# Altium project PCB_Slave_Traffic_Light.PrjPcb (part 2 of 4)
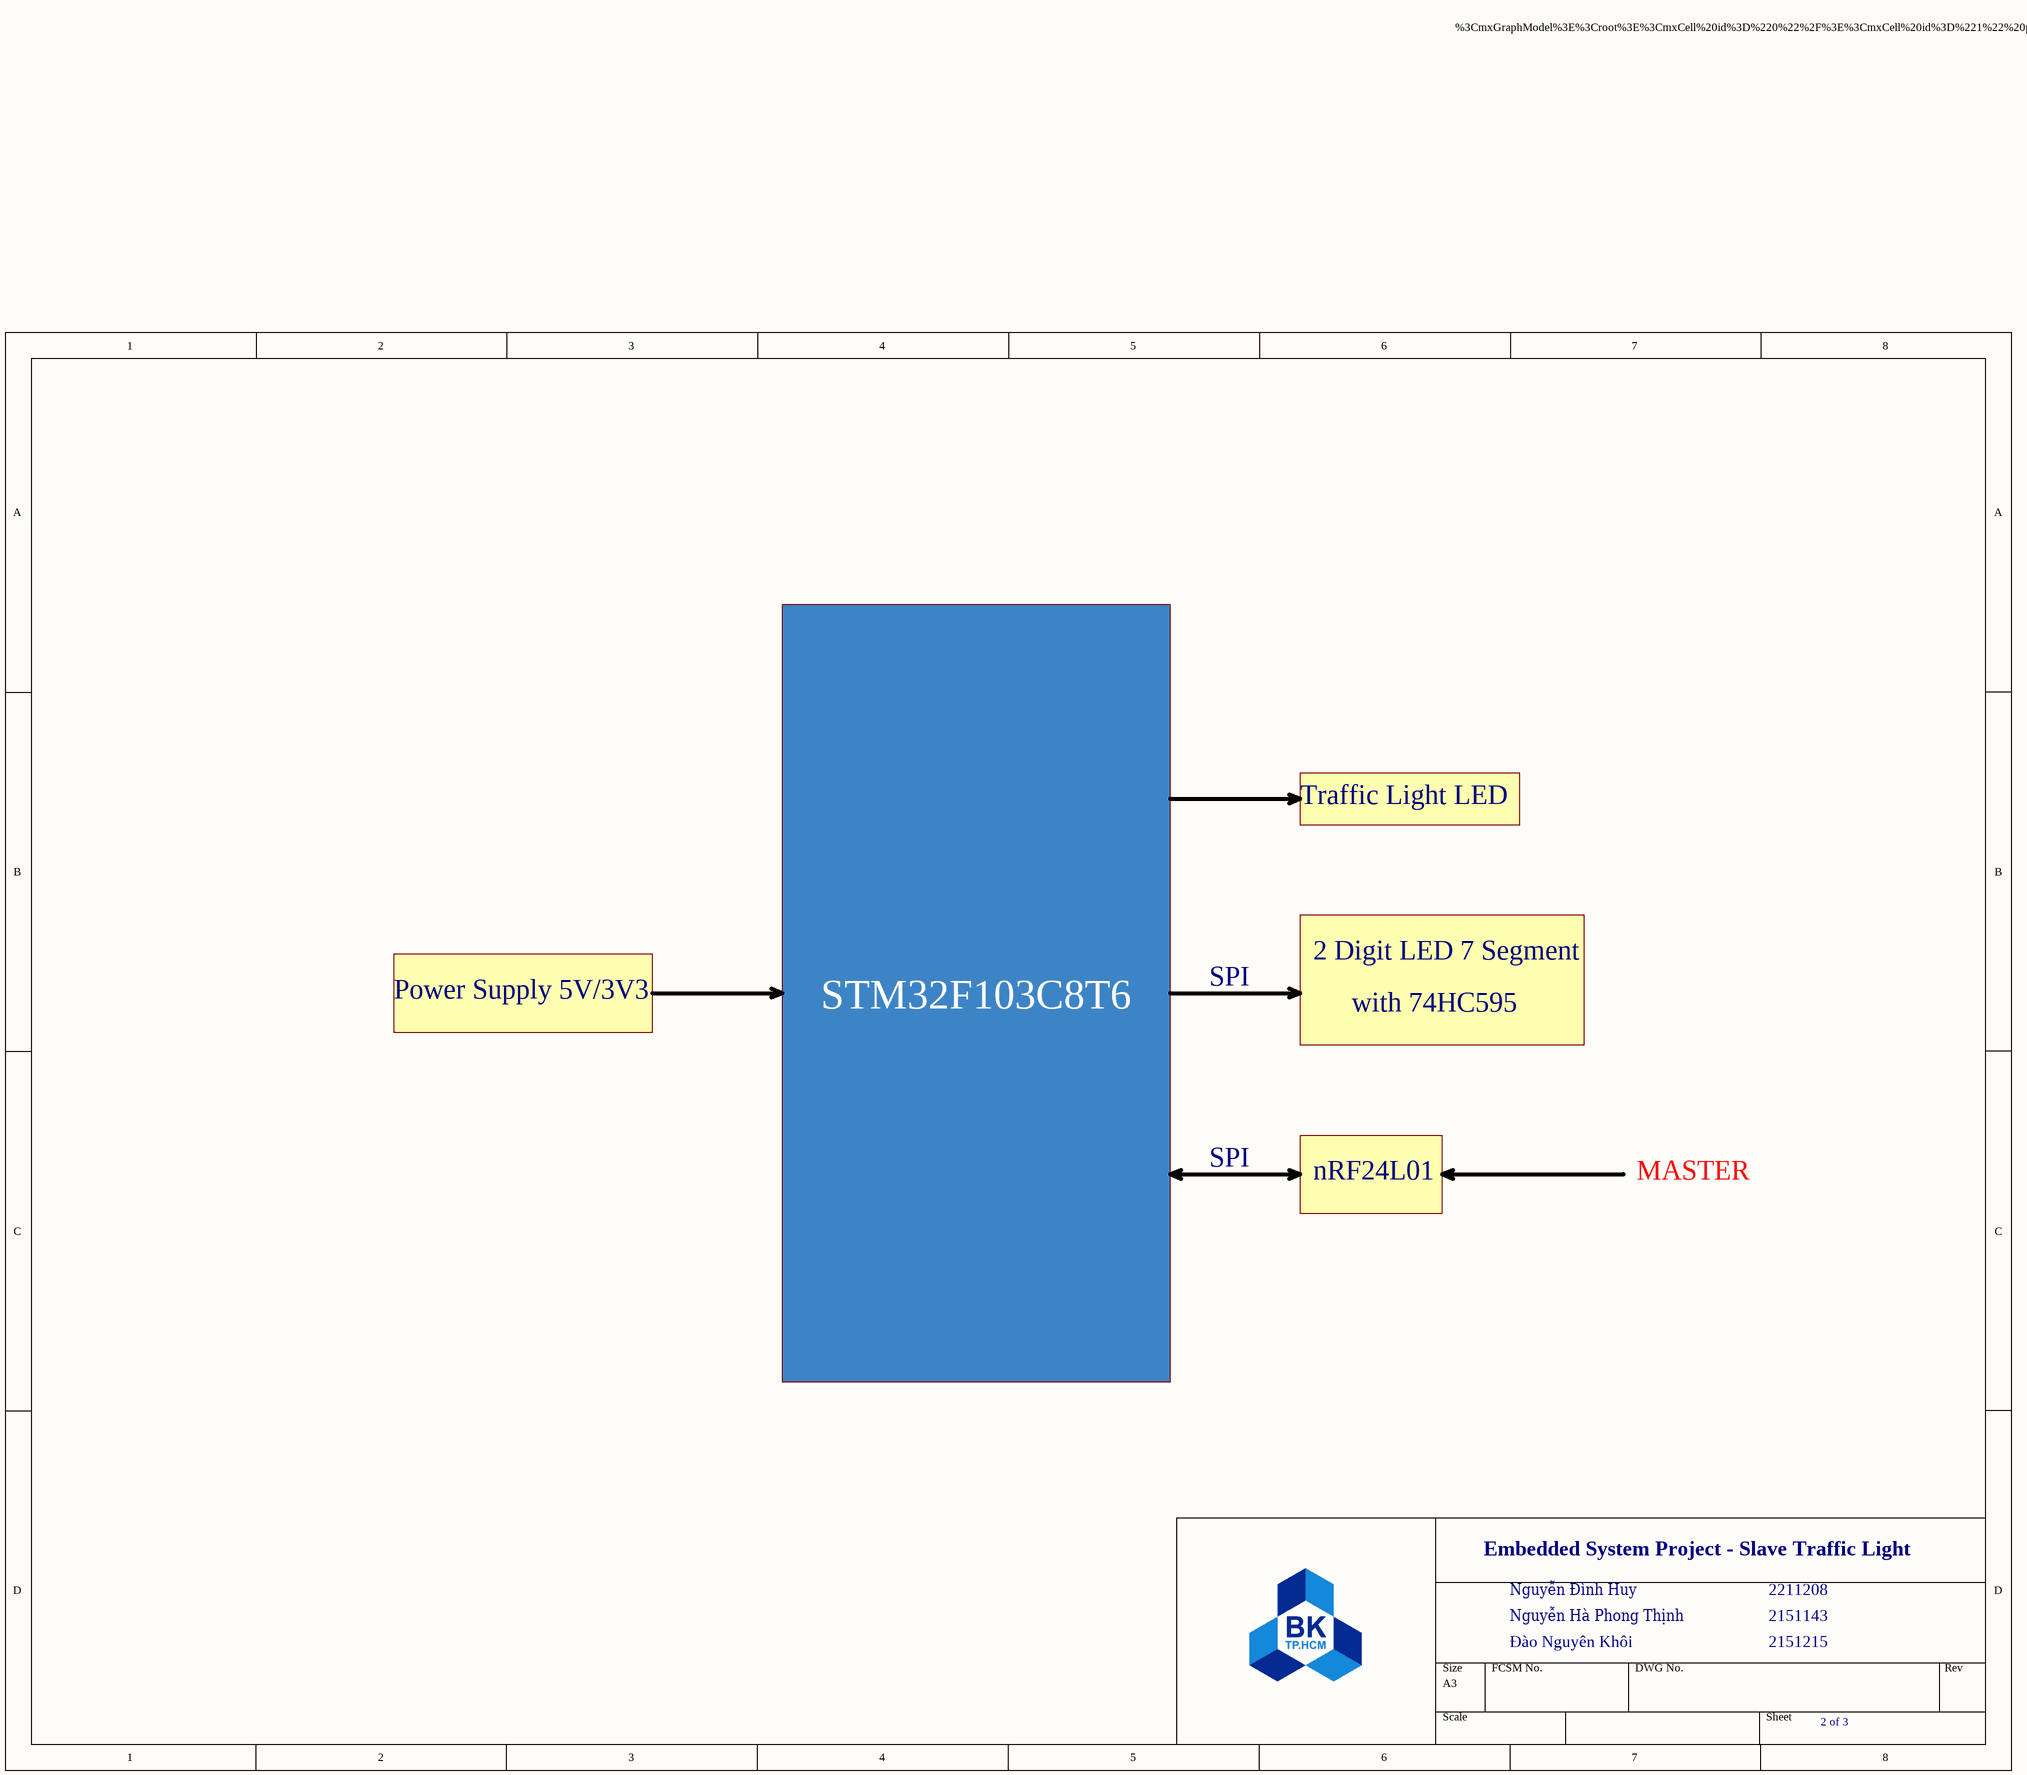
[diagram p3: PCB_Slave_Traffic_Light_BLOCK_DIAGRAM.SchDoc]

## Sheet PCB_Slave_Traffic_Light_BLOCK_DIAGRAM.SchDoc (continued)
- %3CmxGraphModel%3E%3Croot%3E%3CmxCell%20id%3D%220%22%2F%3E%3CmxCell%20id%3D%221%22%20parent%3D%220%22%2F%3E%3CmxCell%20id%3D%222%22%20value%3D%22%22%20style%3D%22endArrow%3Dnone%3Bhtml%3D1%3Brounded%3D0%3Bmovable%3D1%3Bresizable%3D1%3Brotatable%3D1%3Bdeletable%3D1%3Beditable%3D1%3Blocked%3D0%3Bconnectable%3D1%3B%22%20edge%3D%221%22%20parent%3D%221%22%3E%3CmxGeometry%20width%3D%2250%22%20height%3D%2250%22%20relative%3D%221%22%20as%3D%22geometry%22%3E%3CmxPoint%20x%3D%221039.998461538461%22%20y%3D%221800%22%20as%3D%22sourcePoint%22%2F%3E%3CmxPoint%20x%3D%221039.998461538461%22%20y%3D%221820%22%20as%3D%22targetPoint%22%2F%3E%3C%2FmxGeometry%3E%3C%2FmxCell%3E%3CmxCell%20id%3D%223%22%20value%3D%22%22%20style%3D%22endArrow%3Dnone%3Bhtml%3D1%3Brounded%3D0%3Bmovable%3D1%3Bresizable%3D1%3Brotatable%3D1%3Bdeletable%3D1%3Beditable%3D1%3Blocked%3D0%3Bconnectable%3D1%3B%22%20edge%3D%221%22%20parent%3D%221%22%3E%3CmxGeometry%20width%3D%2250%22%20height%3D%2250%22%20relative%3D%221%22%20as%3D%22geometry%22%3E%3CmxPoint%20x%3D%221010%22%20y%3D%221799.9956410256416%22%20as%3D%22sourcePoint%22%2F%3E%3CmxPoint%20x%3D%221070%22%20y%3D%221799.9956410256416%22%20as%3D%22targetPoint%22%2F%3E%3C%2FmxGeometry%3E%3C%2FmxCell%3E%3CmxCell%20id%3D%224%22%20value%3D%22%22%20style%3D%22endArrow%3Dnone%3Bhtml%3D1%3Brounded%3D0%3Bmovable%3D1%3Bresizable%3D1%3Brotatable%3D1%3Bdeletable%3D1%3Beditable%3D1%3Blocked%3D0%3Bconnectable%3D1%3B%22%20edge%3D%221%22%20parent%3D%221%22%3E%3CmxGeometry%20width%3D%2250%22%20height%3D%2250%22%20relative%3D%221%22%20as%3D%22geometry%22%3E%3CmxPoint%20x%3D%221020%22%20y%3D%221789.9956410256416%22%20as%3D%22sourcePoint%22%2F%3E%3CmxPoint%20x%3D%221060%22%20y%3D%221789.9956410256416%22%20as%3D%22targetPoint%22%2F%3E%3C%2FmxGeometry%3E%3C%2FmxCell%3E%3CmxCell%20id%3D%225%22%20value%3D%22%22%20style%3D%22endArrow%3Dnone%3Bhtml%3D1%3Brounded%3D0%3Bmovable%3D1%3Bresizable%3D1%3Brotatable%3D1%3Bdeletable%3D1%3Beditable%3D1%3Blocked%3D0%3Bconnectable%3D1%3B%22%20edge%3D%221%22%20parent%3D%221%22%3E%3CmxGeometry%20width%3D%2250%22%20height%3D%2250%22%20relative%3D%221%22%20as%3D%22geometry%22%3E%3CmxPoint%20x%3D%221030%22%20y%3D%221778.9956410256416%22%20as%3D%22sourcePoint%22%2F%3E%3CmxPoint%20x%3D%221050%22%20y%3D%221778.9956410256416%22%20as%3D%22targetPoint%22%2F%3E%3C%2FmxGeometry%3E%3C%2FmxCell%3E%3CmxCell%20id%3D%226%22%20value%3D%22STM32%22%20style%3D%22rounded%3D0%3BwhiteSpace%3Dwrap%3Bhtml%3D1%3B%22%20vertex%3D%221%22%20parent%3D%221%22%3E%3CmxGeometry%20x%3D%22634.4%22%20y%3D%221594%22%20width%3D%22120%22%20height%3D%22200%22%20as%3D%22geometry%22%2F%3E%3C%2FmxCell%3E%3CmxCell%20id%3D%227%22%20style%3D%22edgeStyle%3DorthogonalEdgeStyle%3Brounded%3D0%3BorthogonalLoop%3D1%3BjettySize%3Dauto%3Bhtml%3D1%3BexitX%3D0%3BexitY%3D0.25%3BexitDx%3D0%3BexitDy%3D0%3BendArrow%3Dnone%3BstartFill%3D0%3B%22%20edge%3D%221%22%20source%3D%229%22%20parent%3D%221%22%3E%3CmxGeometry%20relative%3D%221%22%20as%3D%22geometry%22%3E%3CmxPoint%20x%3D%22840%22%20y%3D%221580%22%20as%3D%22targetPoint%22%2F%3E%3CArray%20as%3D%22points%22%3E%3CmxPoint%20x%3D%22840%22%20y%3D%221574%22%2F%3E%3C%2FArray%3E%3C%2FmxGeometry%3E%3C%2FmxCell%3E%3CmxCell%20id%3D%228%22%20style%3D%22edgeStyle%3DorthogonalEdgeStyle%3Brounded%3D0%3BorthogonalLoop%3D1%3BjettySize%3Dauto%3Bhtml%3D1%3BexitX%3D1%3BexitY%3D0.25%3BexitDx%3D0%3BexitDy%3D0%3BendArrow%3Dnone%3BstartFill%3D0%3B%22%20edge%3D%221%22%20parent%3D%221%22%3E%3CmxGeometry%20relative%3D%221%22%20as%3D%22geometry%22%3E%3CmxPoint%20x%3D%221240%22%20y%3D%221573.7955555555554%22%20as%3D%22targetPoint%22%2F%3E%3CmxPoint%20x%3D%221104.4%22%20y%3D%221573.8700000000003%22%20as%3D%22sourcePoint%22%2F%3E%3C%2FmxGeometry%3E%3C%2FmxCell%3E%3CmxCell%20id%3D%229%22%20value%3D%222%20digit%20led%207%26amp%3Bnbsp%3B%26lt%3Bdiv%26gt%3Bsegment%26amp%3Bnbsp%3B%26lt%3Bdiv%26gt%3Bwith%2074hc595%26lt%3B%2Fdiv%26gt%3B%26lt%3B%2Fdiv%26gt%3B%22%20style%3D%22rounded%3D0%3BwhiteSpace%3Dwrap%3Bhtml%3D1%3B%22%20vertex%3D%221%22%20parent%3D%221%22%3E%3CmxGeometry%20x%3D%22944.4%22%20y%3D%221554.13%22%20width%3D%22160%22%20height%3D%2280%22%20as%3D%22geometry%22%2F%3E%3C%2FmxCell%3E%3CmxCell%20id%3D%2210%22%20style%3D%22edgeStyle%3DorthogonalEdgeStyle%3Brounded%3D0%3BorthogonalLoop%3D1%3BjettySize%3Dauto%3Bhtml%3D1%3BexitX%3D0%3BexitY%3D0.5%3BexitDx%3D0%3BexitDy%3D0%3BendArrow%3Dnone%3BstartFill%3D0%3B%22%20edge%3D%221%22%20source%3D%2212%22%20parent%3D%221%22%3E%3CmxGeometry%20relative%3D%221%22%20as%3D%22geometry%22%3E%3CmxPoint%20x%3D%22840%22%20y%3D%221839.8596491228068%22%20as%3D%22targetPoint%22%2F%3E%3C%2FmxGeometry%3E%3C%2FmxCell%3E%3CmxCell%20id%3D%2211%22%20style%3D%22edgeStyle%3DorthogonalEdgeStyle%3Brounded%3D0%3BorthogonalLoop%3D1%3BjettySize%3Dauto%3Bhtml%3D1%3BexitX%3D1%3BexitY%3D0.5%3BexitDx%3D0%3BexitDy%3D0%3BendArrow%3Dnone%3BstartFill%3D0%3B%22%20edge%3D%221%22%20source%3D%2212%22%20parent%3D%221%22%3E%3CmxGeometry%20relative%3D%221%22%20as%3D%22geometry%22%3E%3CmxPoint%20x%3D%22920%22%20y%3D%221820%22%20as%3D%22targetPoint%22%2F%3E%3C%2FmxGeometry%3E%3C%2FmxCell%3E%3CmxCell%20id%3D%2212%22%20value%3D%22%22%20style%3D%22ellipse%3BwhiteSpace%3Dwrap%3Bhtml%3D1%3Baspect%3Dfixed%3B%22%20vertex%3D%221%22%20parent%3D%221%22%3E%3CmxGeometry%20x%3D%22870%22%20y%3D%221830%22%20width%3D%2220%22%20height%3D%2220%22%20as%3D%22geometry%22%2F%3E%3C%2FmxCell%3E%3CmxCell%20id%3D%2213%22%20style%3D%22edgeStyle%3DorthogonalEdgeStyle%3Brounded%3D0%3BorthogonalLoop%3D1%3BjettySize%3Dauto%3Bhtml%3D1%3BexitX%3D0%3BexitY%3D0.5%3BexitDx%3D0%3BexitDy%3D0%3BendArrow%3Dnone%3BstartFill%3D0%3B%22%20edge%3D%221%22%20source%3D%2215%22%20parent%3D%221%22%3E%3CmxGeometry%20relative%3D%221%22%20as%3D%22geometry%22%3E%3CmxPoint%20x%3D%22960%22%20y%3D%221839.9824561403507%22%20as%3D%22targetPoint%22%2F%3E%3C%2FmxGeometry%3E%3C%2FmxCell%3E%3CmxCell%20id%3D%2214%22%20style%3D%22edgeStyle%3DorthogonalEdgeStyle%3Brounded%3D0%3BorthogonalLoop%3D1%3BjettySize%3Dauto%3Bhtml%3D1%3BexitX%3D1%3BexitY%3D0.5%3BexitDx%3D0%3BexitDy%3D0%3BendArrow%3Dnone%3BstartFill%3D0%3B%22%20edge%3D%221%22%20source%3D%2215%22%20parent%3D%221%22%3E%3CmxGeometry%20relative%3D%221%22%20as%3D%22geometry%22%3E%3CmxPoint%20x%3D%221040%22%20y%3D%221820%22%20as%3D%22targetPoint%22%2F%3E%3C%2FmxGeometry%3E%3C%2FmxCell%3E%3CmxCell%20id%3D%2215%22%20value%3D%22%22%20style%3D%22ellipse%3BwhiteSpace%3Dwrap%3Bhtml%3D1%3Baspect%3Dfixed%3B%22%20vertex%3D%221%22%20parent%3D%221%22%3E%3CmxGeometry%20x%3D%22990%22%20y%3D%221830%22%20width%3D%2220%22%20height%3D%2220%22%20as%3D%22geometry%22%2F%3E%3C%2FmxCell%3E%3CmxCell%20id%3D%2216%22%20style%3D%22edgeStyle%3DorthogonalEdgeStyle%3Brounded%3D0%3BorthogonalLoop%3D1%3BjettySize%3Dauto%3Bhtml%3D1%3BexitX%3D0%3BexitY%3D0.5%3BexitDx%3D0%3BexitDy%3D0%3BendArrow%3Dnone%3BstartFill%3D0%3B%22%20edge%3D%221%22%20source%3D%2218%22%20parent%3D%221%22%3E%3CmxGeometry%20relative%3D%221%22%20as%3D%22geometry%22%3E%3CmxPoint%20x%3D%22760%22%20y%3D%221879.8596491228068%22%20as%3D%22targetPoint%22%2F%3E%3C%2FmxGeometry%3E%3C%2FmxCell%3E%3CmxCell%20id%3D%2217%22%20style%3D%22edgeStyle%3DorthogonalEdgeStyle%3Brounded%3D0%3BorthogonalLoop%3D1%3BjettySize%3Dauto%3Bhtml%3D1%3BexitX%3D1%3BexitY%3D0.5%3BexitDx%3D0%3BexitDy%3D0%3BendArrow%3Dnone%3BstartFill%3D0%3B%22%20edge%3D%221%22%20source%3D%2218%22%20parent%3D%221%22%3E%3CmxGeometry%20relative%3D%221%22%20as%3D%22geometry%22%3E%3CmxPoint%20x%3D%22840%22%20y%3D%221900%22%20as%3D%22targetPoint%22%2F%3E%3C%2FmxGeometry%3E%3C%2FmxCell%3E%3CmxCell%20id%3D%2218%22%20value%3D%22%22%20style%3D%22ellipse%3BwhiteSpace%3Dwrap%3Bhtml%3D1%3Baspect%3Dfixed%3B%22%20vertex%3D%221%22%20parent%3D%221%22%3E%3CmxGeometry%20x%3D%22790%22%20y%3D%221870%22%20width%3D%2220%22%20height%3D%2220%22%20as%3D%22geometry%22%2F%3E%3C%2FmxCell%3E%3CmxCell%20id%3D%2219%22%20style%3D%22edgeStyle%3DorthogonalEdgeStyle%3Brounded%3D0%3BorthogonalLoop%3D1%3BjettySize%3Dauto%3Bhtml%3D1%3BexitX%3D0%3BexitY%3D0.5%3BexitDx%3D0%3BexitDy%3D0%3BendArrow%3Dnone%3BstartFill%3D0%3B%22%20edge%3D%221%22%20source%3D%2221%22%20parent%3D%221%22%3E%3CmxGeometry%20relative%3D%221%22%20as%3D%22geometry%22%3E%3CmxPoint%20x%3D%22880%22%20y%3D%221879.8596491228068%22%20as%3D%22targetPoint%22%2F%3E%3C%2FmxGeometry%3E%3C%2FmxCell%3E%3CmxCell%20id%3D%2220%22%20style%3D%22edgeStyle%3DorthogonalEdgeStyle%3Brounded%3D0%3BorthogonalLoop%3D1%3BjettySize%3Dauto%3Bhtml%3D1%3BexitX%3D1%3BexitY%3D0.5%3BexitDx%3D0%3BexitDy%3D0%3BendArrow%3Dnone%3BstartFill%3D0%3B%22%20edge%3D%221%22%20source%3D%2221%22%20parent%3D%221%22%3E%3CmxGeometry%20relative%3D%221%22%20as%3D%22geometry%22%3E%3CmxPoint%20x%3D%22960%22%20y%3D%221900%22%20as%3D%22targetPoint%22%2F%3E%3C%2FmxGeometry%3E%3C%2FmxCell%3E%3CmxCell%20id%3D%2221%22%20value%3D%22%22%20style%3D%22ellipse%3BwhiteSpace%3Dwrap%3Bhtml%3D1%3Baspect%3Dfixed%3B%22%20vertex%3D%221%22%20parent%3D%221%22%3E%3CmxGeometry%20x%3D%22908.04%22%20y%3D%221870%22%20width%3D%2220%22%20height%3D%2220%22%20as%3D%22geometry%22%2F%3E%3C%2FmxCell%3E%3CmxCell%20id%3D%2222%22%20style%3D%22edgeStyle%3DorthogonalEdgeStyle%3Brounded%3D0%3BorthogonalLoop%3D1%3BjettySize%3Dauto%3Bhtml%3D1%3BexitX%3D0%3BexitY%3D0.5%3BexitDx%3D0%3BexitDy%3D0%3BendArrow%3Dnone%3BstartFill%3D0%3B%22%20edge%3D%221%22%20source%3D%2224%22%20parent%3D%221%22%3E%3CmxGeometry%20relative%3D%221%22%20as%3D%22geometry%22%3E%3CmxPoint%20x%3D%221000%22%20y%3D%221879.8596491228068%22%20as%3D%22targetPoint%22%2F%3E%3C%2FmxGeometry%3E%3C%2FmxCell%3E%3CmxCell%20id%3D%2223%22%20style%3D%22edgeStyle%3DorthogonalEdgeStyle%3Brounded%3D0%3BorthogonalLoop%3D1%3BjettySize%3Dauto%3Bhtml%3D1%3BexitX%3D1%3BexitY%3D0.5%3BexitDx%3D0%3BexitDy%3D0%3BendArrow%3Dnone%3BstartFill%3D0%3B%22%20edge%3D%221%22%20source%3D%2224%22%20parent%3D%221%22%3E%3CmxGeometry%20relative%3D%221%22%20as%3D%22geometry%22%3E%3CmxPoint%20x%3D%221080%22%20y%3D%221900%22%20as%3D%22targetPoint%22%2F%3E%3C%2FmxGeometry%3E%3C%2FmxCell%3E%3CmxCell%20id%3D%2224%22%20value%3D%22%22%20style%3D%22ellipse%3BwhiteSpace%3Dwrap%3Bhtml%3D1%3Baspect%3Dfixed%3B%22%20vertex%3D%221%22%20parent%3D%221%22%3E%3CmxGeometry%20x%3D%221030%22%20y%3D%221870%22%20width%3D%2220%22%20height%3D%2220%22%20as%3D%22geometry%22%2F%3E%3C%2FmxCell%3E%3CmxCell%20id%3D%2225%22%20value%3D%22LCD%2016x2%26lt%3Bdiv%26gt%3B%2B%26lt%3B%2Fdiv%26gt%3B%26lt%3Bdiv%26gt%3BI2C%20Module%26lt%3B%2Fdiv%26gt%3B%22%20style%3D%22rounded%3D0%3BwhiteSpace%3Dwrap%3Bhtml%3D1%3Brotation%3D0%3B%22%20vertex%3D%221%22%20parent%3D%221%22%3E%3CmxGeometry%20x%3D%22234.4%22%20y%3D%221754%22%20width%3D%22120%22%20height%3D%22240%22%20as%3D%22geometry%22%2F%3E%3C%2FmxCell%3E%3CmxCell%20id%3D%2226%22%20value%3D%22AC%26amp%3Bnbsp%3B%26lt%3Bdiv%26gt%3BConnector%26lt%3B%2Fdiv%26gt%3B%22%20style%3D%22rounded%3D0%3BwhiteSpace%3Dwrap%3Bhtml%3D1%3B%22%20vertex%3D%221%22%20parent%3D%221%22%3E%3CmxGeometry%20x%3D%2280%22%20y%3D%221553.46%22%20width%3D%22130%22%20height%3D%2280%22%20as%3D%22geometry%22%2F%3E%3C%2FmxCell%3E%3CmxCell%20id%3D%2227%22%20value%3D%22AC-DC%26amp%3Bnbsp%3B%26lt%3Bdiv%26gt%3BConverter%26lt%3B%2Fdiv%26gt%3B%22%20style%3D%22rounded%3D0%3BwhiteSpace%3Dwrap%3Bhtml%3D1%3B%22%20vertex%3D%221%22%20parent%3D%221%22%3E%3CmxGeometry%20x%3D%22240%22%20y%3D%221553.46%22%20width%3D%22160%22%20height%3D%2280%22%20as%3D%22geometry%22%2F%3E%3C%2FmxCell%3E%3CUserObject%20label%3D%22%26lt%3Ba%20href%3D%26quot%3Bhttps%3A%2F%2Fwww.thegioiic.com%2Fmodule-2-led-7-doan-0-5inch-74hc595-5vdc%26quot%3B%26gt%3BModule%202%20LED%207%20%C4%90o%E1%BA%A1n%200.5inch%2074HC595%205VDC%20%C4%90%E1%BB%8F%2C%20v%C3%A0o%3A%205VDC%2C%20k%C3%ADch%20th%C6%B0%E1%BB%9Bc%3A%2038x25mm%26lt%3B%2Fa%26gt%3B%22%20link%3D%22%26lt%3Ba%20href%3D%26quot%3Bhttps%3A%2F%2Fhshop.vn%2Fmach-hien-thi-2-led-7-doan-0-5-inch-74hc595%26quot%3B%26gt%3BM%E1%BA%A1ch%20hi%E1%BB%83n%20th%E1%BB%8B%20Led%207%20%C4%91o%E1%BA%A1n%2074HC595%202-Digit%20Display%200.56%20Inch%20Module%26lt%3B%2Fa%26gt%3B%22%20id%3D%2228%22%3E%3CmxCell%20style%3D%22text%3BwhiteSpace%3Dwrap%3Bhtml%3D1%3B%22%20vertex%3D%221%22%20parent%3D%221%22%3E%3CmxGeometry%20x%3D%22944.4%22%20y%3D%221634.13%22%20width%3D%22162.72%22%20height%3D%2252%22%20as%3D%22geometry%22%2F%3E%3C%2FmxCell%3E%3C%2FUserObject%3E%3CUserObject%20label%3D%22%26lt%3Ba%20href%3D%26quot%3Bhttps%3A%2F%2Fwww.thegioiic.com%2Fmach-chuyen-doi-ac-dc-vao-220v-ra-5v-700ma-3-3v-600ma-3-5w%26quot%3B%26gt%3BM%E1%BA%A1ch%20Chuy%E1%BB%83n%20%C4%90%E1%BB%95i%20AC-DC%20V%C3%A0o%20220V%20Ra%205V%20700mA%2C%203.3V%20600mA%203.5W%20%C4%90i%E1%BB%87n%20%C3%A1p%20v%C3%A0o%3A%20220VAC%26lt%3B%2Fa%26gt%3B%22%20link%3D%22%26lt%3Ba%20href%3D%26quot%3Bhttps%3A%2F%2Fwww.thegioiic.com%2Fmach-chuyen-doi-ac-dc-vao-220v-ra-5v-700ma-3-3v-600ma-3-5w%26quot%3B%26gt%3BM%E1%BA%A1ch%20Chuy%E1%BB%83n%20%C4%90%E1%BB%95i%20AC-DC%20V%C3%A0o%20220V%20Ra%205V%20700mA%2C%203.3V%20600mA%203.5W%20%C4%90i%E1%BB%87n%20%C3%A1p%20v%C3%A0o%3A%20220VAC%26lt%3B%2Fa%26gt%3B%22%20id%3D%2229%22%3E%3CmxCell%20style%3D%22text%3BwhiteSpace%3Dwrap%3Bhtml%3D1%3B%22%20vertex%3D%221%22%20parent%3D%221%22%3E%3CmxGeometry%20x%3D%22240%22%20y%3D%221633.46%22%20width%3D%22160%22%20height%3D%2280%22%20as%3D%22geometry%22%2F%3E%3C%2FmxCell%3E%3C%2FUserObject%3E%3CUserObject%20label%3D%22%26lt%3Ba%20href%3D%26quot%3Bhttps%3A%2F%2Fwww.thegioiic.com%2Fac005-dau-noi-nguon-ac-c8-han-pcb-2-5a%26quot%3B%26gt%3BAC005%20%C4%90%E1%BA%A7u%20N%E1%BB%91i%20Ngu%E1%BB%93n%20AC%20C8%20H%C3%A0n%20PCB%202.5A%20220VAC%205A%26lt%3B%2Fa%26gt%3B%22%20link%3D%22%26lt%3Ba%20href%3D%26quot%3Bhttps%3A%2F%2Fwww.thegioiic.com%2Fac005-dau-noi-nguon-ac-c8-han-pcb-2-5a%26quot%3B%26gt%3BAC005%20%C4%90%E1%BA%A7u%20N%E1%BB%91i%20Ngu%E1%BB%93n%20AC%20C8%20H%C3%A0n%20PCB%202.5A%20220VAC%205A%26lt%3B%2Fa%26gt%3B%22%20id%3D%2230%22%3E%3CmxCell%20style%3D%22text%3BwhiteSpace%3Dwrap%3Bhtml%3D1%3B%22%20vertex%3D%221%22%20parent%3D%221%22%3E%3CmxGeometry%20x%3D%2280%22%20y%3D%221633.46%22%20width%3D%22130%22%20height%3D%2280%22%20as%3D%22geometry%22%2F%3E%3C%2FmxCell%3E%3C%2FUserObject%3E%3CUserObject%20label%3D%22%26lt%3Ba%20href%3D%26quot%3Bhttps%3A%2F%2Fwww.thegioiic.com%2Fday-cap-nguon-ac-5a-220vac-so-8-dai-1m-c7-noi-phich-cam-us%26quot%3B%26gt%3BD%C3%A2y%20C%C3%A1p%20Ngu%E1%BB%93n%20AC%205A%20220VAC%20S%E1%BB%91%208%20D%C3%A0i%201m%2C%20C7%20N%E1%BB%91i%20Ph%C3%ADch%20C%E1%BA%AFm%20US%2C%20PVC%2C%20m%C3%A0u%20%C4%91en%26lt%3B%2Fa%26gt%3B%22%20link%3D%22%26lt%3Ba%20href%3D%26quot%3Bhttps%3A%2F%2Fwww.thegioiic.com%2Fday-cap-nguon-ac-5a-220vac-so-8-dai-1m-c7-noi-phich-cam-us%26quot%3B%26gt%3BD%C3%A2y%20C%C3%A1p%20Ngu%E1%BB%93n%20AC%205A%20220VAC%20S%E1%BB%91%208%20D%C3%A0i%201m%2C%20C7%20N%E1%BB%91i%20Ph%C3%ADch%20C%E1%BA%AFm%20US%2C%20PVC%2C%20m%C3%A0u%20%C4%91en%26lt%3B%2Fa%26gt%3B%22%20id%3D%2231%22%3E%3CmxCell%20style%3D%22text%3BwhiteSpace%3Dwrap%3Bhtml%3D1%3B%22%20vertex%3D%221%22%20parent%3D%221%22%3E%3CmxGeometry%20y%3D%221553.46%22%20width%3D%2280%22%20height%3D%22130%22%20as%3D%22geometry%22%2F%3E%3C%2FmxCell%3E%3C%2FUserObject%3E%3CUserObject%20label%3D%22%26lt%3Ba%20href%3D%26quot%3Bhttps%3A%2F%2Fwww.thegioiic.com%2Fmach-stm32f103c8t6-micro-usb%26quot%3B%26gt%3BM%E1%BA%A1ch%20STM32F103C8T6%20Micro%20USB%20%C4%90i%E1%BB%87n%20%C3%A1p%20I%2FO%3A%202~3.6%20VDC%26lt%3B%2Fa%26gt%3B%22%20link%3D%22%26lt%3Ba%20href%3D%26quot%3Bhttps%3A%2F%2Fwww.thegioiic.com%2Fmach-stm32f103c8t6-micro-usb%26quot%3B%26gt%3BM%E1%BA%A1ch%20STM32F103C8T6%20Micro%20USB%20%C4%90i%E1%BB%87n%20%C3%A1p%20I%2FO%3A%202~3.6%20VDC%26lt%3B%2Fa%26gt%3B%22%20id%3D%2232%22%3E%3CmxCell%20style%3D%22text%3BwhiteSpace%3Dwrap%3Bhtml%3D1%3B%22%20vertex%3D%221%22%20parent%3D%221%22%3E%3CmxGeometry%20x%3D%22634.4%22%20y%3D%221794%22%20width%3D%22120%22%20height%3D%2270%22%20as%3D%22geometry%22%2F%3E%3C%2FmxCell%3E%3C%2FUserObject%3E%3CUserObject%20label%3D%22%26lt%3Ba%20href%3D%26quot%3Bhttps%3A%2F%2Fwww.thegioiic.com%2Fnut-nhan-6x6mm-cao-7mm-4-chan-xuyen-lo%26quot%3B%26gt%3BN%C3%BAt%20Nh%E1%BA%A5n%206x6mm%20Cao%207mm%204%20Ch%C3%A2n%20Xuy%C3%AAn%20L%E1%BB%97%2012VDC%2050mA%26lt%3B%2Fa%26gt%3B%22%20link%3D%22%26lt%3Ba%20href%3D%26quot%3Bhttps%3A%2F%2Fwww.thegioiic.com%2Fnut-nhan-6x6mm-cao-7mm-4-chan-xuyen-lo%26quot%3B%26gt%3BN%C3%BAt%20Nh%E1%BA%A5n%206x6mm%20Cao%207mm%204%20Ch%C3%A2n%20Xuy%C3%AAn%20L%E1%BB%97%2012VDC%2050mA%26lt%3B%2Fa%26gt%3B%22%20id%3D%2233%22%3E%3CmxCell%20style%3D%22text%3BwhiteSpace%3Dwrap%3Bhtml%3D1%3B%22%20vertex%3D%221%22%20parent%3D%221%22%3E%3CmxGeometry%20x%3D%22841.68%22%20y%3D%221984%22%20width%3D%22100%22%20height%3D%2240%22%20as%3D%22geometry%22%2F%3E%3C%2FmxCell%3E%3C%2FUserObject%3E%3CUserObject%20label%3D%22%26lt%3Ba%20href%3D%26quot%3Bhttps%3A%2F%2Fwww.thegioiic.com%2Flcd-1602-nen-xanh-la-chu-den-5v-kem-i2c-driver%26quot%3B%26gt%3BLCD%201602%20N%E1%BB%81n%20Xanh%20L%C3%A1%20Ch%E1%BB%AF%20%C4%90en%205V%20K%C3%A8m%20I2C%20Driver%26lt%3B%2Fa%26gt%3B%22%20link%3D%22%26lt%3Ba%20href%3D%26quot%3Bhttps%3A%2F%2Fwww.thegioiic.com%2Flcd-1602-nen-vang-xanh-chu-den-5v%26quot%3B%26gt%3BLCD%201602%20N%E1%BB%81n%20V%C3%A0ng%20Xanh%20Ch%E1%BB%AF%20%C4%90en%205V%2C%2016x02%20k%C3%BD%20t%E1%BB%B1%2C%20ngu%E1%BB%93n%3A%205VDC%26lt%3B%2Fa%26gt%3B%22%20id%3D%2234%22%3E%3CmxCell%20style%3D%22text%3BwhiteSpace%3Dwrap%3Bhtml%3D1%3B%22%20vertex%3D%221%22%20parent%3D%221%22%3E%3CmxGeometry%20x%3D%22234.4%22%20y%3D%221994%22%20width%3D%22120%22%20height%3D%2250%22%20as%3D%22geometry%22%2F%3E%3C%2FmxCell%3E%3C%2FUserObject%3E%3CUserObject%20label%3D%22%26lt%3Ba%20href%3D%26quot%3Bhttps%3A%2F%2Fwww.thegioiic.com%2Fnrf24l01-mach-thu-phat-rf-2-4ghz%26quot%3B%26gt%3BNRF24L01%20M%E1%BA%A1ch%20Thu%20Ph%C3%A1t%20RF%202.4GHz%202.4GHz%20Wireless%20nRF24L01%2B%20Module%26lt%3B%2Fa%26gt%3B%22%20link%3D%22%26lt%3Ba%20href%3D%26quot%3Bhttps%3A%2F%2Fwww.thegioiic.com%2Fnrf24l01-mach-thu-phat-rf-2-4ghz%26quot%3B%26gt%3BNRF24L01%20M%E1%BA%A1ch%20Thu%20Ph%C3%A1t%20RF%202.4GHz%202.4GHz%20Wireless%20nRF24L01%2B%20Module%26lt%3B%2Fa%26gt%3B%22%20id%3D%2235%22%3E%3CmxCell%20style%3D%22text%3BwhiteSpace%3Dwrap%3Bhtml%3D1%3B%22%20vertex%3D%221%22%20parent%3D%221%22%3E%3CmxGeometry%20x%3D%22230%22%20y%3D%221400%22%20width%3D%22160%22%20height%3D%22125%22%20as%3D%22geometry%22%2F%3E%3C%2FmxCell%3E%3C%2FUserObject%3E%3CmxCell%20id%3D%2236%22%20value%3D%22NRF24L01%22%20style%3D%22rounded%3D0%3BwhiteSpace%3Dwrap%3Bhtml%3D1%3B%22%20vertex%3D%221%22%20parent%3D%221%22%3E%3CmxGeometry%20x%3D%22230%22%20y%3D%221280%22%20width%3D%22160%22%20height%3D%22120%22%20as%3D%22geometry%22%2F%3E%3C%2FmxCell%3E%3CmxCell%20id%3D%2237%22%20value%3D%22%22%20style%3D%22triangle%3BwhiteSpace%3Dwrap%3Bhtml%3D1%3B%22%20vertex%3D%221%22%20parent%3D%221%22%3E%3CmxGeometry%20x%3D%22589.6%22%20y%3D%221340%22%20width%3D%2220%22%20height%3D%2220%22%20as%3D%22geometry%22%2F%3E%3C%2FmxCell%3E%3CmxCell%20id%3D%2238%22%20value%3D%22%22%20style%3D%22endArrow%3Dnone%3Bhtml%3D1%3Brounded%3D0%3B%22%20edge%3D%221%22%20parent%3D%221%22%3E%3CmxGeometry%20width%3D%2250%22%20height%3D%2250%22%20relative%3D%221%22%20as%3D%22geometry%22%3E%3CmxPoint%20x%3D%22609.6%22%20y%3D%221360%22%20as%3D%22sourcePoint%22%2F%3E%3CmxPoint%20x%3D%22609.6%22%20y%3D%221340%22%20as%3D%22targetPoint%22%2F%3E%3CArray%20as%3D%22points%22%3E%3CmxPoint%20x%3D%22609.6%22%20y%3D%221350%22%2F%3E%3C%2FArray%3E%3C%2FmxGeometry%3E%3C%2FmxCell%3E%3CmxCell%20id%3D%2239%22%20value%3D%22%22%20style%3D%22triangle%3BwhiteSpace%3Dwrap%3Bhtml%3D1%3B%22%20vertex%3D%221%22%20parent%3D%221%22%3E%3CmxGeometry%20x%3D%22590%22%20y%3D%221380%22%20width%3D%2220%22%20height%3D%2220%22%20as%3D%22geometry%22%2F%3E%3C%2FmxCell%3E%3CmxCell%20id%3D%2240%22%20value%3D%22%22%20style%3D%22endArrow%3Dnone%3Bhtml%3D1%3Brounded%3D0%3B%22%20edge%3D%221%22%20parent%3D%221%22%3E%3CmxGeometry%20width%3D%2250%22%20height%3D%2250%22%20relative%3D%221%22%20as%3D%22geometry%22%3E%3CmxPoint%20x%3D%22610%22%20y%3D%221400%22%20as%3D%22sourcePoint%22%2F%3E%3CmxPoint%20x%3D%22610%22%20y%3D%221380%22%20as%3D%22targetPoint%22%2F%3E%3CArray%20as%3D%22points%22%3E%3CmxPoint%20x%3D%22610%22%20y%3D%221390%22%2F%3E%3C%2FArray%3E%3C%2FmxGeometry%3E%3C%2FmxCell%3E%3CmxCell%20id%3D%2241%22%20value%3D%22%22%20style%3D%22triangle%3BwhiteSpace%3Dwrap%3Bhtml%3D1%3B%22%20vertex%3D%221%22%20parent%3D%221%22%3E%3CmxGeometry%20x%3D%22590%22%20y%3D%221420%22%20width%3D%2220%22%20height%3D%2220%22%20as%3D%22geometry%22%2F%3E%3C%2FmxCell%3E%3CmxCell%20id%3D%2242%22%20value%3D%22%22%20style%3D%22endArrow%3Dnone%3Bhtml%3D1%3Brounded%3D0%3B%22%20edge%3D%221%22%20parent%3D%221%22%3E%3CmxGeometry%20width%3D%2250%22%20height%3D%2250%22%20relative%3D%221%22%20as%3D%22geometry%22%3E%3CmxPoint%20x%3D%22610%22%20y%3D%221440%22%20as%3D%22sourcePoint%22%2F%3E%3CmxPoint%20x%3D%22610%22%20y%3D%221420%22%20as%3D%22targetPoint%22%2F%3E%3CArray%20as%3D%22points%22%3E%3CmxPoint%20x%3D%22610%22%20y%3D%221430%22%2F%3E%3C%2FArray%3E%3C%2FmxGeometry%3E%3C%2FmxCell%3E%3CmxCell%20id%3D%2243%22%20value%3D%22%22%20style%3D%22endArrow%3Dnone%3Bhtml%3D1%3Brounded%3D0%3B%22%20edge%3D%221%22%20parent%3D%221%22%3E%3CmxGeometry%20width%3D%2250%22%20height%3D%2250%22%20relative%3D%221%22%20as%3D%22geometry%22%3E%3CmxPoint%20x%3D%22670%22%20y%3D%221460%22%20as%3D%22sourcePoint%22%2F%3E%3CmxPoint%20x%3D%22670%22%20y%3D%221440%22%20as%3D%22targetPoint%22%2F%3E%3C%2FmxGeometry%3E%3C%2FmxCell%3E%3CmxCell%20id%3D%2244%22%20value%3D%22%22%20style%3D%22endArrow%3Dnone%3Bhtml%3D1%3Brounded%3D0%3B%22%20edge%3D%221%22%20parent%3D%221%22%3E%3CmxGeometry%20width%3D%2250%22%20height%3D%2250%22%20relative%3D%221%22%20as%3D%22geometry%22%3E%3CmxPoint%20x%3D%22640%22%20y%3D%221460%22%20as%3D%22sourcePoint%22%2F%3E%3CmxPoint%20x%3D%22700%22%20y%3D%221460%22%20as%3D%22targetPoint%22%2F%3E%3C%2FmxGeometry%3E%3C%2FmxCell%3E%3CmxCell%20id%3D%2245%22%20value%3D%22%22%20style%3D%22endArrow%3Dnone%3Bhtml%3D1%3Brounded%3D0%3B%22%20edge%3D%221%22%20parent%3D%221%22%3E%3CmxGeometry%20width%3D%2250%22%20height%3D%2250%22%20relative%3D%221%22%20as%3D%22geometry%22%3E%3CmxPoint%20x%3D%22650%22%20y%3D%221470%22%20as%3D%22sourcePoint%22%2F%3E%3CmxPoint%20x%3D%22690%22%20y%3D%221470%22%20as%3D%22targetPoint%22%2F%3E%3C%2FmxGeometry%3E%3C%2FmxCell%3E%3CmxCell%20id%3D%2246%22%20value%3D%22%22%20style%3D%22endArrow%3Dnone%3Bhtml%3D1%3Brounded%3D0%3B%22%20edge%3D%221%22%20parent%3D%221%22%3E%3CmxGeometry%20width%3D%2250%22%20height%3D%2250%22%20relative%3D%221%22%20as%3D%22geometry%22%3E%3CmxPoint%20x%3D%22660%22%20y%3D%221480%22%20as%3D%22sourcePoint%22%2F%3E%3CmxPoint%20x%3D%22680%22%20y%3D%221480%22%20as%3D%22targetPoint%22%2F%3E%3C%2FmxGeometry%3E%3C%2FmxCell%3E%3CmxCell%20id%3D%2247%22%20value%3D%22%22%20style%3D%22endArrow%3Dnone%3Bhtml%3D1%3Brounded%3D0%3B%22%20edge%3D%221%22%20parent%3D%221%22%3E%3CmxGeometry%20width%3D%2250%22%20height%3D%2250%22%20relative%3D%221%22%20as%3D%22geometry%22%3E%3CmxPoint%20x%3D%22564.4%22%20y%3D%221812.92%22%20as%3D%22sourcePoint%22%2F%3E%3CmxPoint%20x%3D%22624.4%22%20y%3D%221812.92%22%20as%3D%22targetPoint%22%2F%3E%3C%2FmxGeometry%3E%3C%2FmxCell%3E%3CmxCell%20id%3D%2248%22%20value%3D%22%22%20style%3D%22endArrow%3Dnone%3Bhtml%3D1%3Brounded%3D0%3B%22%20edge%3D%221%22%20parent%3D%221%22%3E%3CmxGeometry%20width%3D%2250%22%20height%3D%2250%22%20relative%3D%221%22%20as%3D%22geometry%22%3E%3CmxPoint%20x%3D%22574.4%22%20y%3D%221822.92%22%20as%3D%22sourcePoint%22%2F%3E%3CmxPoint%20x%3D%22614.4%22%20y%3D%221822.92%22%20as%3D%22targetPoint%22%2F%3E%3C%2FmxGeometry%3E%3C%2FmxCell%3E%3CmxCell%20id%3D%2249%22%20value%3D%22%22%20style%3D%22endArrow%3Dnone%3Bhtml%3D1%3Brounded%3D0%3B%22%20edge%3D%221%22%20parent%3D%221%22%3E%3CmxGeometry%20width%3D%2250%22%20height%3D%2250%22%20relative%3D%221%22%20as%3D%22geometry%22%3E%3CmxPoint%20x%3D%22584.4%22%20y%3D%221832.92%22%20as%3D%22sourcePoint%22%2F%3E%3CmxPoint%20x%3D%22604.4%22%20y%3D%221832.92%22%20as%3D%22targetPoint%22%2F%3E%3C%2FmxGeometry%3E%3C%2FmxCell%3E%3CmxCell%20id%3D%2250%22%20value%3D%22%22%20style%3D%22endArrow%3Dnone%3Bhtml%3D1%3Brounded%3D0%3B%22%20edge%3D%221%22%20parent%3D%221%22%3E%3CmxGeometry%20width%3D%2250%22%20height%3D%2250%22%20relative%3D%221%22%20as%3D%22geometry%22%3E%3CmxPoint%20x%3D%221240.0000000000002%22%20y%3D%221593.3%22%20as%3D%22sourcePoint%22%2F%3E%3CmxPoint%20x%3D%221240.0000000000002%22%20y%3D%221573.3%22%20as%3D%22targetPoint%22%2F%3E%3C%2FmxGeometry%3E%3C%2FmxCell%3E%3CmxCell%20id%3D%2251%22%20value%3D%22%22%20style%3D%22endArrow%3Dnone%3Bhtml%3D1%3Brounded%3D0%3B%22%20edge%3D%221%22%20parent%3D%221%22%3E%3CmxGeometry%20width%3D%2250%22%20height%3D%2250%22%20relative%3D%221%22%20as%3D%22geometry%22%3E%3CmxPoint%20x%3D%221212%22%20y%3D%221593.4399999999998%22%20as%3D%22sourcePoint%22%2F%3E%3CmxPoint%20x%3D%221269.1200000000001%22%20y%3D%221593.29%22%20as%3D%22targetPoint%22%2F%3E%3C%2FmxGeometry%3E%3C%2FmxCell%3E%3CmxCell%20id%3D%2252%22%20value%3D%22%22%20style%3D%22endArrow%3Dnone%3Bhtml%3D1%3Brounded%3D0%3B%22%20edge%3D%221%22%20parent%3D%221%22%3E%3CmxGeometry%20width%3D%2250%22%20height%3D%2250%22%20relative%3D%221%22%20as%3D%22geometry%22%3E%3CmxPoint%20x%3D%221219.1200000000001%22%20y%3D%221603.29%22%20as%3D%22sourcePoint%22%2F%3E%3CmxPoint%20x%3D%221259.1200000000001%22%20y%3D%221603.29%22%20as%3D%22targetPoint%22%2F%3E%3C%2FmxGeometry%3E%3C%2FmxCell%3E%3CmxCell%20id%3D%2253%22%20value%3D%22%22%20style%3D%22endArrow%3Dnone%3Bhtml%3D1%3Brounded%3D0%3B%22%20edge%3D%221%22%20parent%3D%221%22%3E%3CmxGeometry%20width%3D%2250%22%20height%3D%2250%22%20relative%3D%221%22%20as%3D%22geometry%22%3E%3CmxPoint%20x%3D%221229.1200000000001%22%20y%3D%221613.29%22%20as%3D%22sourcePoint%22%2F%3E%3CmxPoint%20x%3D%221249.1200000000001%22%20y%3D%221613.29%22%20as%3D%22targetPoint%22%2F%3E%3C%2FmxGeometry%3E%3C%2FmxCell%3E%3CmxCell%20id%3D%2254%22%20value%3D%22%22%20style%3D%22endArrow%3Dnone%3Bhtml%3D1%3Brounded%3D0%3B%22%20edge%3D%221%22%20parent%3D%221%22%3E%3CmxGeometry%20width%3D%2250%22%20height%3D%2250%22%20relative%3D%221%22%20as%3D%22geometry%22%3E%3CmxPoint%20x%3D%22400%22%20y%3D%221420%22%20as%3D%22sourcePoint%22%2F%3E%3CmxPoint%20x%3D%22440%22%20y%3D%221420%22%20as%3D%22targetPoint%22%2F%3E%3C%2FmxGeometry%3E%3C%2FmxCell%3E%3CmxCell%20id%3D%2255%22%20value%3D%22%22%20style%3D%22endArrow%3Dnone%3Bhtml%3D1%3Brounded%3D0%3B%22%20edge%3D%221%22%20parent%3D%221%22%3E%3CmxGeometry%20width%3D%2250%22%20height%3D%2250%22%20relative%3D%221%22%20as%3D%22geometry%22%3E%3CmxPoint%20x%3D%22410%22%20y%3D%221430%22%20as%3D%22sourcePoint%22%2F%3E%3CmxPoint%20x%3D%22430%22%20y%3D%221430%22%20as%3D%22targetPoint%22%2F%3E%3C%2FmxGeometry%3E%3C%2FmxCell%3E%3CmxCell%20id%3D%2256%22%20value%3D%22%22%20style%3D%22endArrow%3Dnone%3Bhtml%3D1%3Brounded%3D0%3B%22%20edge%3D%221%22%20parent%3D%221%22%3E%3CmxGeometry%20width%3D%2250%22%20height%3D%2250%22%20relative%3D%221%22%20as%3D%22geometry%22%3E%3CmxPoint%20x%3D%22163%22%20y%3D%222014%22%20as%3D%22sourcePoint%22%2F%3E%3CmxPoint%20x%3D%22223%22%20y%3D%222014%22%20as%3D%22targetPoint%22%2F%3E%3C%2FmxGeometry%3E%3C%2FmxCell%3E%3CmxCell%20id%3D%2257%22%20value%3D%22%22%20style%3D%22endArrow%3Dnone%3Bhtml%3D1%3Brounded%3D0%3B%22%20edge%3D%221%22%20parent%3D%221%22%3E%3CmxGeometry%20width%3D%2250%22%20height%3D%2250%22%20relative%3D%221%22%20as%3D%22geometry%22%3E%3CmxPoint%20x%3D%22173%22%20y%3D%222024%22%20as%3D%22sourcePoint%22%2F%3E%3CmxPoint%20x%3D%22213%22%20y%3D%222024%22%20as%3D%22targetPoint%22%2F%3E%3C%2FmxGeometry%3E%3C%2FmxCell%3E%3CmxCell%20id%3D%2258%22%20value%3D%22%22%20style%3D%22endArrow%3Dnone%3Bhtml%3D1%3Brounded%3D0%3B%22%20edge%3D%221%22%20parent%3D%221%22%3E%3CmxGeometry%20width%3D%2250%22%20height%3D%2250%22%20relative%3D%221%22%20as%3D%22geometry%22%3E%3CmxPoint%20x%3D%22183%22%20y%3D%222034%22%20as%3D%22sourcePoint%22%2F%3E%3CmxPoint%20x%3D%22203%22%20y%3D%222034%22%20as%3D%22targetPoint%22%2F%3E%3C%2FmxGeometry%3E%3C%2FmxCell%3E%3CmxCell%20id%3D%2259%22%20value%3D%22%22%20style%3D%22endArrow%3Dnone%3Bhtml%3D1%3Brounded%3D0%3B%22%20edge%3D%221%22%20parent%3D%221%22%3E%3CmxGeometry%20width%3D%2250%22%20height%3D%2250%22%20relative%3D%221%22%20as%3D%22geometry%22%3E%3CmxPoint%20x%3D%22400%22%20y%3D%221420%22%20as%3D%22sourcePoint%22%2F%3E%3CmxPoint%20x%3D%22460%22%20y%3D%221420%22%20as%3D%22targetPoint%22%2F%3E%3C%2FmxGeometry%3E%3C%2FmxCell%3E%3CmxCell%20id%3D%2260%22%20value%3D%22%22%20style%3D%22endArrow%3Dnone%3Bhtml%3D1%3Brounded%3D0%3B%22%20edge%3D%221%22%20parent%3D%221%22%3E%3CmxGeometry%20width%3D%2250%22%20height%3D%2250%22%20relative%3D%221%22%20as%3D%22geometry%22%3E%3CmxPoint%20x%3D%22410%22%20y%3D%221430%22%20as%3D%22sourcePoint%22%2F%3E%3CmxPoint%20x%3D%22450%22%20y%3D%221430%22%20as%3D%22targetPoint%22%2F%3E%3C%2FmxGeometry%3E%3C%2FmxCell%3E%3CmxCell%20id%3D%2261%22%20value%3D%22%22%20style%3D%22endArrow%3Dnone%3Bhtml%3D1%3Brounded%3D0%3B%22%20edge%3D%221%22%20parent%3D%221%22%3E%3CmxGeometry%20width%3D%2250%22%20height%3D%2250%22%20relative%3D%221%22%20as%3D%22geometry%22%3E%3CmxPoint%20x%3D%22420%22%20y%3D%221440%22%20as%3D%22sourcePoint%22%2F%3E%3CmxPoint%20x%3D%22440%22%20y%3D%221440%22%20as%3D%22targetPoint%22%2F%3E%3C%2FmxGeometry%3E%3C%2FmxCell%3E%3CmxCell%20id%3D%2262%22%20value%3D%22%26lt%3Bb%26gt%3B%26lt%3Bfont%20style%3D%26quot%3Bfont-size%3A%2028px%3B%26quot%3B%26gt%3BMaster%26lt%3B%2Ffont%26gt%3B%26lt%3B%2Fb%26gt%3B%22%20style%3D%22text%3Bhtml%3D1%3Balign%3Dcenter%3BverticalAlign%3Dmiddle%3BwhiteSpace%3Dwrap%3Brounded%3D0%3B%22%20vertex%3D%221%22%20parent%3D%221%22%3E%3CmxGeometry%20x%3D%2289%22%20y%3D%221280%22%20width%3D%2260%22%20height%3D%2230%22%20as%3D%22geometry%22%2F%3E%3C%2FmxCell%3E%3CmxCell%20id%3D%2263%22%20value%3D%22%22%20style%3D%22endArrow%3Dnone%3Bhtml%3D1%3Brounded%3D0%3B%22%20edge%3D%221%22%20parent%3D%221%22%3E%3CmxGeometry%20width%3D%2250%22%20height%3D%2250%22%20relative%3D%221%22%20as%3D%22geometry%22%3E%3CmxPoint%20x%3D%22610%22%20y%3D%221350%22%20as%3D%22sourcePoint%22%2F%3E%3CmxPoint%20x%3D%22670%22%20y%3D%221440%22%20as%3D%22targetPoint%22%2F%3E%3CArray%20as%3D%22points%22%3E%3CmxPoint%20x%3D%22670%22%20y%3D%221350%22%2F%3E%3C%2FArray%3E%3C%2FmxGeometry%3E%3C%2FmxCell%3E%3CmxCell%20id%3D%2264%22%20value%3D%22%22%20style%3D%22endArrow%3Dnone%3Bhtml%3D1%3Brounded%3D0%3B%22%20edge%3D%221%22%20parent%3D%221%22%3E%3CmxGeometry%20width%3D%2250%22%20height%3D%2250%22%20relative%3D%221%22%20as%3D%22geometry%22%3E%3CmxPoint%20x%3D%22610%22%20y%3D%221390%22%20as%3D%22sourcePoint%22%2F%3E%3CmxPoint%20x%3D%22670%22%20y%3D%221390%22%20as%3D%22targetPoint%22%2F%3E%3C%2FmxGeometry%3E%3C%2FmxCell%3E%3CmxCell%20id%3D%2265%22%20value%3D%22%22%20style%3D%22endArrow%3Dnone%3Bhtml%3D1%3Brounded%3D0%3B%22%20edge%3D%221%22%20parent%3D%221%22%3E%3CmxGeometry%20width%3D%2250%22%20height%3D%2250%22%20relative%3D%221%22%20as%3D%22geometry%22%3E%3CmxPoint%20x%3D%22609.6%22%20y%3D%221430%22%20as%3D%22sourcePoint%22%2F%3E%3CmxPoint%20x%3D%22670%22%20y%3D%221430%22%20as%3D%22targetPoint%22%2F%3E%3C%2FmxGeometry%3E%3C%2FmxCell%3E%3CmxCell%20id%3D%2266%22%20value%3D%22%22%20style%3D%22endArrow%3Dnone%3Bhtml%3D1%3Brounded%3D0%3BexitX%3D0%3BexitY%3D1%3BexitDx%3D0%3BexitDy%3D0%3B%22%20edge%3D%221%22%20source%3D%2271%22%20parent%3D%221%22%3E%3CmxGeometry%20width%3D%2250%22%20height%3D%2250%22%20relative%3D%221%22%20as%3D%22geometry%22%3E%3CmxPoint%20x%3D%22550%22%20y%3D%221350%22%20as%3D%22sourcePoint%22%2F%3E%3CmxPoint%20x%3D%22589.6%22%20y%3D%221350%22%20as%3D%22targetPoint%22%2F%3E%3C%2FmxGeometry%3E%3C%2FmxCell%3E%3CmxCell%20id%3D%2267%22%20value%3D%22%22%20style%3D%22endArrow%3Dnone%3Bhtml%3D1%3Brounded%3D0%3BexitX%3D0%3BexitY%3D1%3BexitDx%3D0%3BexitDy%3D0%3B%22%20edge%3D%221%22%20source%3D%2270%22%20parent%3D%221%22%3E%3CmxGeometry%20width%3D%2250%22%20height%3D%2250%22%20relative%3D%221%22%20as%3D%22geometry%22%3E%3CmxPoint%20x%3D%22510%22%20y%3D%221390%22%20as%3D%22sourcePoint%22%2F%3E%3CmxPoint%20x%3D%22589.6%22%20y%3D%221389.76%22%20as%3D%22targetPoint%22%2F%3E%3C%2FmxGeometry%3E%3C%2FmxCell%3E%3CmxCell%20id%3D%2268%22%20value%3D%22%22%20style%3D%22endArrow%3Dnone%3Bhtml%3D1%3Brounded%3D0%3BexitX%3D0%3BexitY%3D1%3BexitDx%3D0%3BexitDy%3D0%3B%22%20edge%3D%221%22%20source%3D%2269%22%20parent%3D%221%22%3E%3CmxGeometry%20width%3D%2250%22%20height%3D%2250%22%20relative%3D%221%22%20as%3D%22geometry%22%3E%3CmxPoint%20x%3D%22510%22%20y%3D%221430%22%20as%3D%22sourcePoint%22%2F%3E%3CmxPoint%20x%3D%22590%22%20y%3D%221429.76%22%20as%3D%22targetPoint%22%2F%3E%3C%2FmxGeometry%3E%3C%2FmxCell%3E%3CmxCell%20id%3D%2269%22%20value%3D%22PA8%22%20style%3D%22text%3Bhtml%3D1%3Balign%3Dcenter%3BverticalAlign%3Dmiddle%3BwhiteSpace%3Dwrap%3Brounded%3D0%3B%22%20vertex%3D%221%22%20parent%3D%221%22%3E%3CmxGeometry%20x%3D%22530%22%20y%3D%221420%22%20width%3D%2220%22%20height%3D%2210%22%20as%3D%22geometry%22%2F%3E%3C%2FmxCell%3E%3CmxCell%20id%3D%2270%22%20value%3D%22PA9%22%20style%3D%22text%3Bhtml%3D1%3Balign%3Dcenter%3BverticalAlign%3Dmiddle%3BwhiteSpace%3Dwrap%3Brounded%3D0%3B%22%20vertex%3D%221%22%20parent%3D%221%22%3E%3CmxGeometry%20x%3D%22530%22%20y%3D%221380%22%20width%3D%2220%22%20height%3D%2210%22%20as%3D%22geometry%22%2F%3E%3C%2FmxCell%3E%3CmxCell%20id%3D%2271%22%20value%3D%22PA10%22%20style%3D%22text%3Bhtml%3D1%3Balign%3Dcenter%3BverticalAlign%3Dmiddle%3BwhiteSpace%3Dwrap%3Brounded%3D0%3B%22%20vertex%3D%221%22%20parent%3D%221%22%3E%3CmxGeometry%20x%3D%22530%22%20y%3D%221340%22%20width%3D%2230%22%20height%3D%2210%22%20as%3D%22geometry%22%2F%3E%3C%2FmxCell%3E%3CmxCell%20id%3D%2272%22%20value%3D%22Out5%22%20style%3D%22text%3Bhtml%3D1%3Balign%3Dcenter%3BverticalAlign%3Dmiddle%3BwhiteSpace%3Dwrap%3Brounded%3D0%3B%22%20vertex%3D%221%22%20parent%3D%221%22%3E%3CmxGeometry%20x%3D%22901.68%22%20y%3D%221549.71%22%20width%3D%2232.72%22%20height%3D%2213.92%22%20as%3D%22geometry%22%2F%3E%3C%2FmxCell%3E%3CmxCell%20id%3D%2273%22%20value%3D%22Earth%22%20style%3D%22text%3Bhtml%3D1%3Balign%3Dcenter%3BverticalAlign%3Dmiddle%3BwhiteSpace%3Dwrap%3Brounded%3D0%3B%22%20vertex%3D%221%22%20parent%3D%221%22%3E%3CmxGeometry%20x%3D%22180%22%20y%3D%221553.46%22%20width%3D%2226%22%20height%3D%2215%22%20as%3D%22geometry%22%2F%3E%3C%2FmxCell%3E%3CmxCell%20id%3D%2274%22%20value%3D%22Line%22%20style%3D%22text%3Bhtml%3D1%3Balign%3Dcenter%3BverticalAlign%3Dmiddle%3BwhiteSpace%3Dwrap%3Brounded%3D0%3B%22%20vertex%3D%221%22%20parent%3D%221%22%3E%3CmxGeometry%20x%3D%22180%22%20y%3D%221585.96%22%20width%3D%2226%22%20height%3D%2215%22%20as%3D%22geometry%22%2F%3E%3C%2FmxCell%3E%3CmxCell%20id%3D%2275%22%20value%3D%22Neutral%22%20style%3D%22text%3Bhtml%3D1%3Balign%3Dcenter%3BverticalAlign%3Dmiddle%3BwhiteSpace%3Dwrap%3Brounded%3D0%3B%22%20vertex%3D%221%22%20parent%3D%221%22%3E%3CmxGeometry%20x%3D%22170%22%20y%3D%221618.46%22%20width%3D%2236%22%20height%3D%2215%22%20as%3D%22geometry%22%2F%3E%3C%2FmxCell%3E%3CmxCell%20id%3D%2276%22%20value%3D%22Earth%22%20style%3D%22text%3Bhtml%3D1%3Balign%3Dcenter%3BverticalAlign%3Dmiddle%3BwhiteSpace%3Dwrap%3Brounded%3D0%3B%22%20vertex%3D%221%22%20parent%3D%221%22%3E%3CmxGeometry%20x%3D%22247%22%20y%3D%221553.46%22%20width%3D%2226%22%20height%3D%2215%22%20as%3D%22geometry%22%2F%3E%3C%2FmxCell%3E%3CmxCell%20id%3D%2277%22%20value%3D%22Line%22%20style%3D%22text%3Bhtml%3D1%3Balign%3Dcenter%3BverticalAlign%3Dmiddle%3BwhiteSpace%3Dwrap%3Brounded%3D0%3B%22%20vertex%3D%221%22%20parent%3D%221%22%3E%3CmxGeometry%20x%3D%22247%22%20y%3D%221585.96%22%20width%3D%2226%22%20height%3D%2215%22%20as%3D%22geometry%22%2F%3E%3C%2FmxCell%3E%3CmxCell%20id%3D%2278%22%20value%3D%22Neutral%22%20style%3D%22text%3Bhtml%3D1%3Balign%3Dcenter%3BverticalAlign%3Dmiddle%3BwhiteSpace%3Dwrap%3Brounded%3D0%3B%22%20vertex%3D%221%22%20parent%3D%221%22%3E%3CmxGeometry%20x%3D%22247%22%20y%3D%221618.46%22%20width%3D%2243%22%20height%3D%2215%22%20as%3D%22geometry%22%2F%3E%3C%2FmxCell%3E%3CmxCell%20id%3D%2279%22%20value%3D%22%22%20style%3D%22endArrow%3Dnone%3Bhtml%3D1%3Brounded%3D0%3BentryX%3D0%3BentryY%3D0.112%3BentryDx%3D0%3BentryDy%3D0%3BentryPerimeter%3D0%3B%22%20edge%3D%221%22%20target%3D%2227%22%20parent%3D%221%22%3E%3CmxGeometry%20width%3D%2250%22%20height%3D%2250%22%20relative%3D%221%22%20as%3D%22geometry%22%3E%3CmxPoint%20x%3D%22210%22%20y%3D%221562.38%22%20as%3D%22sourcePoint%22%2F%3E%3CmxPoint%20x%3D%22260%22%20y%3D%221512.38%22%20as%3D%22targetPoint%22%2F%3E%3C%2FmxGeometry%3E%3C%2FmxCell%3E%3CmxCell%20id%3D%2280%22%20value%3D%22%22%20style%3D%22endArrow%3Dnone%3Bhtml%3D1%3Brounded%3D0%3BentryX%3D0%3BentryY%3D0.496%3BentryDx%3D0%3BentryDy%3D0%3BentryPerimeter%3D0%3B%22%20edge%3D%221%22%20target%3D%2227%22%20parent%3D%221%22%3E%3CmxGeometry%20width%3D%2250%22%20height%3D%2250%22%20relative%3D%221%22%20as%3D%22geometry%22%3E%3CmxPoint%20x%3D%22210%22%20y%3D%221593.3500000000001%22%20as%3D%22sourcePoint%22%2F%3E%3CmxPoint%20x%3D%22240%22%20y%3D%221593.43%22%20as%3D%22targetPoint%22%2F%3E%3C%2FmxGeometry%3E%3C%2FmxCell%3E%3CmxCell%20id%3D%2281%22%20value%3D%22%22%20style%3D%22endArrow%3Dnone%3Bhtml%3D1%3Brounded%3D0%3BentryX%3D0.002%3BentryY%3D0.112%3BentryDx%3D0%3BentryDy%3D0%3BentryPerimeter%3D0%3B%22%20edge%3D%221%22%20parent%3D%221%22%3E%3CmxGeometry%20width%3D%2250%22%20height%3D%2250%22%20relative%3D%221%22%20as%3D%22geometry%22%3E%3CmxPoint%20x%3D%22210%22%20y%3D%221627.2700000000002%22%20as%3D%22sourcePoint%22%2F%3E%3CmxPoint%20x%3D%22240%22%20y%3D%221627.3500000000001%22%20as%3D%22targetPoint%22%2F%3E%3C%2FmxGeometry%3E%3C%2FmxCell%3E%3CmxCell%20id%3D%2282%22%20value%3D%22%22%20style%3D%22endArrow%3Dnone%3Bhtml%3D1%3Brounded%3D0%3BentryX%3D1%3BentryY%3D0.5%3BentryDx%3D0%3BentryDy%3D0%3BentryPerimeter%3D0%3B%22%20edge%3D%221%22%20target%3D%22108%22%20parent%3D%221%22%3E%3CmxGeometry%20width%3D%2250%22%20height%3D%2250%22%20relative%3D%221%22%20as%3D%22geometry%22%3E%3CmxPoint%20x%3D%22400%22%20y%3D%221617.38%22%20as%3D%22sourcePoint%22%2F%3E%3CmxPoint%20x%3D%22524.4%22%20y%3D%221617%22%20as%3D%22targetPoint%22%2F%3E%3CArray%20as%3D%22points%22%3E%3CmxPoint%20x%3D%22514.4%22%20y%3D%221617%22%2F%3E%3C%2FArray%3E%3C%2FmxGeometry%3E%3C%2FmxCell%3E%3CmxCell%20id%3D%2283%22%20value%3D%22%22%20style%3D%22endArrow%3Dnone%3Bhtml%3D1%3Brounded%3D0%3B%22%20edge%3D%221%22%20parent%3D%221%22%3E%3CmxGeometry%20width%3D%2250%22%20height%3D%2250%22%20relative%3D%221%22%20as%3D%22geometry%22%3E%3CmxPoint%20x%3D%22400%22%20y%3D%221568.46%22%20as%3D%22sourcePoint%22%2F%3E%3CmxPoint%20x%3D%22450%22%20y%3D%221568.46%22%20as%3D%22targetPoint%22%2F%3E%3C%2FmxGeometry%3E%3C%2FmxCell%3E%3CmxCell%20id%3D%2284%22%20value%3D%22Out5%22%20style%3D%22text%3Bhtml%3D1%3Balign%3Dcenter%3BverticalAlign%3Dmiddle%3BwhiteSpace%3Dwrap%3Brounded%3D0%3B%22%20vertex%3D%221%22%20parent%3D%221%22%3E%3CmxGeometry%20x%3D%22420%22%20y%3D%221556.96%22%20width%3D%2230%22%20height%3D%228%22%20as%3D%22geometry%22%2F%3E%3C%2FmxCell%3E%3CmxCell%20id%3D%2285%22%20value%3D%22Out3.3%22%20style%3D%22text%3Bhtml%3D1%3Balign%3Dcenter%3BverticalAlign%3Dmiddle%3BwhiteSpace%3Dwrap%3Brounded%3D0%3B%22%20vertex%3D%221%22%20parent%3D%221%22%3E%3CmxGeometry%20x%3D%22414%22%20y%3D%221603.38%22%20width%3D%2240.4%22%20height%3D%228%22%20as%3D%22geometry%22%2F%3E%3C%2FmxCell%3E%3CmxCell%20id%3D%2286%22%20style%3D%22edgeStyle%3DorthogonalEdgeStyle%3Brounded%3D0%3BorthogonalLoop%3D1%3BjettySize%3Dauto%3Bhtml%3D1%3BexitX%3D1%3BexitY%3D0.5%3BexitDx%3D0%3BexitDy%3D0%3BendArrow%3Dnone%3BstartFill%3D0%3B%22%20edge%3D%221%22%20source%3D%2287%22%20parent%3D%221%22%3E%3CmxGeometry%20relative%3D%221%22%20as%3D%22geometry%22%3E%3CmxPoint%20x%3D%22794.4%22%20y%3D%221598.5146198830407%22%20as%3D%22targetPoint%22%2F%3E%3C%2FmxGeometry%3E%3C%2FmxCell%3E%3CmxCell%20id%3D%2287%22%20value%3D%22%26lt%3Bfont%20style%3D%26quot%3Bfont-size%3A%2010px%3B%26quot%3B%26gt%3B3V3%26lt%3B%2Ffont%26gt%3B%22%20style%3D%22text%3Bhtml%3D1%3Balign%3Dcenter%3BverticalAlign%3Dmiddle%3BwhiteSpace%3Dwrap%3Brounded%3D0%3B%22%20vertex%3D%221%22%20parent%3D%221%22%3E%3CmxGeometry%20x%3D%22734.4%22%20y%3D%221594%22%20width%3D%2220%22%20height%3D%228.92%22%20as%3D%22geometry%22%2F%3E%3C%2FmxCell%3E%3CmxCell%20id%3D%2288%22%20style%3D%22edgeStyle%3DorthogonalEdgeStyle%3Brounded%3D0%3BorthogonalLoop%3D1%3BjettySize%3Dauto%3Bhtml%3D1%3BexitX%3D1%3BexitY%3D0.5%3BexitDx%3D0%3BexitDy%3D0%3BendArrow%3Dnone%3BstartFill%3D0%3B%22%20edge%3D%221%22%20source%3D%2289%22%20parent%3D%221%22%3E%3CmxGeometry%20relative%3D%221%22%20as%3D%22geometry%22%3E%3CmxPoint%20x%3D%22794.4%22%20y%3D%221617.9298245614034%22%20as%3D%22targetPoint%22%2F%3E%3C%2FmxGeometry%3E%3C%2FmxCell%3E%3CmxCell%20id%3D%2289%22%20value%3D%22%26lt%3Bfont%20style%3D%26quot%3Bfont-size%3A%2010px%3B%26quot%3B%26gt%3B5V%26lt%3B%2Ffont%26gt%3B%22%20style%3D%22text%3Bhtml%3D1%3Balign%3Dcenter%3BverticalAlign%3Dmiddle%3BwhiteSpace%3Dwrap%3Brounded%3D0%3B%22%20vertex%3D%221%22%20parent%3D%221%22%3E%3CmxGeometry%20x%3D%22734.4%22%20y%3D%221613.46%22%20width%3D%2220%22%20height%3D%228.92%22%20as%3D%22geometry%22%2F%3E%3C%2FmxCell%3E%3CmxCell%20id%3D%2290%22%20value%3D%22%22%20style%3D%22endArrow%3Dnone%3Bhtml%3D1%3Brounded%3D0%3BentryX%3D-0.003%3BentryY%3D0.145%3BentryDx%3D0%3BentryDy%3D0%3BentryPerimeter%3D0%3B%22%20edge%3D%221%22%20target%3D%229%22%20parent%3D%221%22%3E%3CmxGeometry%20width%3D%2250%22%20height%3D%2250%22%20relative%3D%221%22%20as%3D%22geometry%22%3E%3CmxPoint%20x%3D%22907.12%22%20y%3D%221566.13%22%20as%3D%22sourcePoint%22%2F%3E%3CmxPoint%20x%3D%22907.12%22%20y%3D%221526.13%22%20as%3D%22targetPoint%22%2F%3E%3C%2FmxGeometry%3E%3C%2FmxCell%3E%3CmxCell%20id%3D%2291%22%20value%3D%22%26lt%3Bfont%20style%3D%26quot%3Bfont-size%3A%2010px%3B%26quot%3B%26gt%3BGND%26lt%3B%2Ffont%26gt%3B%22%20style%3D%22text%3Bhtml%3D1%3Balign%3Dcenter%3BverticalAlign%3Dmiddle%3BwhiteSpace%3Dwrap%3Brounded%3D0%3B%22%20vertex%3D%221%22%20parent%3D%221%22%3E%3CmxGeometry%20x%3D%22634.4%22%20y%3D%221784%22%20width%3D%2230%22%20height%3D%2210%22%20as%3D%22geometry%22%2F%3E%3C%2FmxCell%3E%3CmxCell%20id%3D%2292%22%20style%3D%22edgeStyle%3DorthogonalEdgeStyle%3Brounded%3D0%3BorthogonalLoop%3D1%3BjettySize%3Dauto%3Bhtml%3D1%3BexitX%3D0%3BexitY%3D0.5%3BexitDx%3D0%3BexitDy%3D0%3BendArrow%3Dnone%3BstartFill%3D0%3B%22%20edge%3D%221%22%20source%3D%2293%22%20parent%3D%221%22%3E%3CmxGeometry%20relative%3D%221%22%20as%3D%22geometry%22%3E%3CmxPoint%20x%3D%22594.4%22%20y%3D%221804%22%20as%3D%22targetPoint%22%2F%3E%3CArray%20as%3D%22points%22%3E%3CmxPoint%20x%3D%22594.4%22%20y%3D%221779%22%2F%3E%3C%2FArray%3E%3C%2FmxGeometry%3E%3C%2FmxCell%3E%3CmxCell%20id%3D%2293%22%20value%3D%22%26lt%3Bfont%20style%3D%26quot%3Bfont-size%3A%2010px%3B%26quot%3B%26gt%3BGND%26lt%3B%2Ffont%26gt%3B%22%20style%3D%22text%3Bhtml%3D1%3Balign%3Dcenter%3BverticalAlign%3Dmiddle%3BwhiteSpace%3Dwrap%3Brounded%3D0%3B%22%20vertex%3D%221%22%20parent%3D%221%22%3E%3CmxGeometry%20x%3D%22634.4%22%20y%3D%221774%22%20width%3D%2230%22%20height%3D%2210%22%20as%3D%22geometry%22%2F%3E%3C%2FmxCell%3E%3CmxCell%20id%3D%2294%22%20value%3D%22%22%20style%3D%22endArrow%3Dnone%3Bhtml%3D1%3Brounded%3D0%3BentryX%3D0%3BentryY%3D0.5%3BentryDx%3D0%3BentryDy%3D0%3B%22%20edge%3D%221%22%20target%3D%2291%22%20parent%3D%221%22%3E%3CmxGeometry%20width%3D%2250%22%20height%3D%2250%22%20relative%3D%221%22%20as%3D%22geometry%22%3E%3CmxPoint%20x%3D%22594.4%22%20y%3D%221812.92%22%20as%3D%22sourcePoint%22%2F%3E%3CmxPoint%20x%3D%22624.4%22%20y%3D%221784%22%20as%3D%22targetPoint%22%2F%3E%3CArray%20as%3D%22points%22%3E%3CmxPoint%20x%3D%22594.4%22%20y%3D%221789%22%2F%3E%3C%2FArray%3E%3C%2FmxGeometry%3E%3C%2FmxCell%3E%3CmxCell%20id%3D%2295%22%20value%3D%22%26lt%3Bfont%20style%3D%26quot%3Bfont-size%3A%2010px%3B%26quot%3B%26gt%3B3V3%26lt%3B%2Ffont%26gt%3B%22%20style%3D%22text%3Bhtml%3D1%3Balign%3Dcenter%3BverticalAlign%3Dmiddle%3BwhiteSpace%3Dwrap%3Brounded%3D0%3B%22%20vertex%3D%221%22%20parent%3D%221%22%3E%3CmxGeometry%20x%3D%22634.4%22%20y%3D%221764%22%20width%3D%2230%22%20height%3D%2210%22%20as%3D%22geometry%22%2F%3E%3C%2FmxCell%3E%3CmxCell%20id%3D%2296%22%20style%3D%22edgeStyle%3DorthogonalEdgeStyle%3Brounded%3D0%3BorthogonalLoop%3D1%3BjettySize%3Dauto%3Bhtml%3D1%3BexitX%3D0%3BexitY%3D0.5%3BexitDx%3D0%3BexitDy%3D0%3BendArrow%3Dnone%3BstartFill%3D0%3B%22%20edge%3D%221%22%20source%3D%2297%22%20parent%3D%221%22%3E%3CmxGeometry%20relative%3D%221%22%20as%3D%22geometry%22%3E%3CmxPoint%20x%3D%22514.4%22%20y%3D%221774%22%20as%3D%22targetPoint%22%2F%3E%3CArray%20as%3D%22points%22%3E%3CmxPoint%20x%3D%22514.4%22%20y%3D%221759%22%2F%3E%3CmxPoint%20x%3D%22514.4%22%20y%3D%221774%22%2F%3E%3C%2FArray%3E%3C%2FmxGeometry%3E%3C%2FmxCell%3E%3CmxCell%20id%3D%2297%22%20value%3D%22%26lt%3Bfont%20style%3D%26quot%3Bfont-size%3A%2010px%3B%26quot%3B%26gt%3BNRST%26lt%3B%2Ffont%26gt%3B%22%20style%3D%22text%3Bhtml%3D1%3Balign%3Dcenter%3BverticalAlign%3Dmiddle%3BwhiteSpace%3Dwrap%3Brounded%3D0%3B%22%20vertex%3D%221%22%20parent%3D%221%22%3E%3CmxGeometry%20x%3D%22634.4%22%20y%3D%221754%22%20width%3D%2230%22%20height%3D%2210%22%20as%3D%22geometry%22%2F%3E%3C%2FmxCell%3E%3CmxCell%20id%3D%2298%22%20value%3D%22%22%20style%3D%22endArrow%3Dnone%3Bhtml%3D1%3Brounded%3D0%3BstrokeWidth%3D5%3B%22%20edge%3D%221%22%20parent%3D%221%22%3E%3CmxGeometry%20width%3D%2250%22%20height%3D%2250%22%20relative%3D%221%22%20as%3D%22geometry%22%3E%3CmxPoint%20x%3D%22504.4%22%20y%3D%221774.04%22%20as%3D%22sourcePoint%22%2F%3E%3CmxPoint%20x%3D%22524.4%22%20y%3D%221774.04%22%20as%3D%22targetPoint%22%2F%3E%3C%2FmxGeometry%3E%3C%2FmxCell%3E%3CmxCell%20id%3D%2299%22%20value%3D%22%22%20style%3D%22endArrow%3Dnone%3Bhtml%3D1%3Brounded%3D0%3BstrokeWidth%3D5%3B%22%20edge%3D%221%22%20parent%3D%221%22%3E%3CmxGeometry%20width%3D%2250%22%20height%3D%2250%22%20relative%3D%221%22%20as%3D%22geometry%22%3E%3CmxPoint%20x%3D%22504.4%22%20y%3D%221783.81%22%20as%3D%22sourcePoint%22%2F%3E%3CmxPoint%20x%3D%22524.4%22%20y%3D%221783.81%22%20as%3D%22targetPoint%22%2F%3E%3C%2FmxGeometry%3E%3C%2FmxCell%3E%3CmxCell%20id%3D%22100%22%20value%3D%22%22%20style%3D%22endArrow%3Dnone%3Bhtml%3D1%3Brounded%3D0%3B%22%20edge%3D%221%22%20parent%3D%221%22%3E%3CmxGeometry%20width%3D%2250%22%20height%3D%2250%22%20relative%3D%221%22%20as%3D%22geometry%22%3E%3CmxPoint%20x%3D%22484.4%22%20y%3D%221812.92%22%20as%3D%22sourcePoint%22%2F%3E%3CmxPoint%20x%3D%22544.4%22%20y%3D%221812.92%22%20as%3D%22targetPoint%22%2F%3E%3C%2FmxGeometry%3E%3C%2FmxCell%3E%3CmxCell%20id%3D%22101%22%20value%3D%22%22%20style%3D%22endArrow%3Dnone%3Bhtml%3D1%3Brounded%3D0%3B%22%20edge%3D%221%22%20parent%3D%221%22%3E%3CmxGeometry%20width%3D%2250%22%20height%3D%2250%22%20relative%3D%221%22%20as%3D%22geometry%22%3E%3CmxPoint%20x%3D%22494.4%22%20y%3D%221822.92%22%20as%3D%22sourcePoint%22%2F%3E%3CmxPoint%20x%3D%22534.4%22%20y%3D%221822.92%22%20as%3D%22targetPoint%22%2F%3E%3C%2FmxGeometry%3E%3C%2FmxCell%3E%3CmxCell%20id%3D%22102%22%20value%3D%22%22%20style%3D%22endArrow%3Dnone%3Bhtml%3D1%3Brounded%3D0%3B%22%20edge%3D%221%22%20parent%3D%221%22%3E%3CmxGeometry%20width%3D%2250%22%20height%3D%2250%22%20relative%3D%221%22%20as%3D%22geometry%22%3E%3CmxPoint%20x%3D%22504.4%22%20y%3D%221832.92%22%20as%3D%22sourcePoint%22%2F%3E%3CmxPoint%20x%3D%22524.4%22%20y%3D%221832.92%22%20as%3D%22targetPoint%22%2F%3E%3C%2FmxGeometry%3E%3C%2FmxCell%3E%3CmxCell%20id%3D%22103%22%20value%3D%22%22%20style%3D%22endArrow%3Dnone%3Bhtml%3D1%3Brounded%3D0%3B%22%20edge%3D%221%22%20parent%3D%221%22%3E%3CmxGeometry%20width%3D%2250%22%20height%3D%2250%22%20relative%3D%221%22%20as%3D%22geometry%22%3E%3CmxPoint%20x%3D%22514.4%22%20y%3D%221812.92%22%20as%3D%22sourcePoint%22%2F%3E%3CmxPoint%20x%3D%22514.4%22%20y%3D%221784%22%20as%3D%22targetPoint%22%2F%3E%3CArray%20as%3D%22points%22%2F%3E%3C%2FmxGeometry%3E%3C%2FmxCell%3E%3CmxCell%20id%3D%22104%22%20value%3D%22%26lt%3Bspan%20style%3D%26quot%3Bfont-size%3A%2010px%3B%26quot%3B%26gt%3BC1%26lt%3B%2Fspan%26gt%3B%26lt%3Bdiv%26gt%3B%26lt%3Bspan%20style%3D%26quot%3Bfont-size%3A%2010px%3B%26quot%3B%26gt%3B10n%26lt%3B%2Fspan%26gt%3B%26lt%3B%2Fdiv%26gt%3B%22%20style%3D%22text%3Bhtml%3D1%3Balign%3Dcenter%3BverticalAlign%3Dmiddle%3BwhiteSpace%3Dwrap%3Brounded%3D0%3B%22%20vertex%3D%221%22%20parent%3D%221%22%3E%3CmxGeometry%20x%3D%22524.4%22%20y%3D%221769%22%20width%3D%2230%22%20height%3D%2220%22%20as%3D%22geometry%22%2F%3E%3C%2FmxCell%3E%3CmxCell%20id%3D%22105%22%20value%3D%22%22%20style%3D%22ellipse%3BwhiteSpace%3Dwrap%3Bhtml%3D1%3Baspect%3Dfixed%3B%22%20vertex%3D%221%22%20parent%3D%221%22%3E%3CmxGeometry%20x%3D%22425%22%20y%3D%221769%22%20width%3D%2220%22%20height%3D%2220%22%20as%3D%22geometry%22%2F%3E%3C%2FmxCell%3E%3CmxCell%20id%3D%22106%22%20value%3D%22%22%20style%3D%22endArrow%3Dnone%3Bhtml%3D1%3Brounded%3D0%3B%22%20edge%3D%221%22%20parent%3D%221%22%3E%3CmxGeometry%20width%3D%2250%22%20height%3D%2250%22%20relative%3D%221%22%20as%3D%22geometry%22%3E%3CmxPoint%20x%3D%22514.4%22%20y%3D%221804%22%20as%3D%22sourcePoint%22%2F%3E%3CmxPoint%20x%3D%22434.4%22%20y%3D%221789%22%20as%3D%22targetPoint%22%2F%3E%3CArray%20as%3D%22points%22%3E%3CmxPoint%20x%3D%22434.4%22%20y%3D%221804%22%2F%3E%3C%2FArray%3E%3C%2FmxGeometry%3E%3C%2FmxCell%3E%3CmxCell%20id%3D%22107%22%20value%3D%22%22%20style%3D%22endArrow%3Dnone%3Bhtml%3D1%3Brounded%3D0%3B%22%20edge%3D%221%22%20parent%3D%221%22%3E%3CmxGeometry%20width%3D%2250%22%20height%3D%2250%22%20relative%3D%221%22%20as%3D%22geometry%22%3E%3CmxPoint%20x%3D%22514%22%20y%3D%221759%22%20as%3D%22sourcePoint%22%2F%3E%3CmxPoint%20x%3D%22434.4%22%20y%3D%221769%22%20as%3D%22targetPoint%22%2F%3E%3CArray%20as%3D%22points%22%3E%3CmxPoint%20x%3D%22434.4%22%20y%3D%221759%22%2F%3E%3C%2FArray%3E%3C%2FmxGeometry%3E%3C%2FmxCell%3E%3CmxCell%20id%3D%22108%22%20value%3D%22%22%20style%3D%22pointerEvents%3D1%3BverticalLabelPosition%3Dbottom%3Bshadow%3D0%3Bdashed%3D0%3Balign%3Dcenter%3Bhtml%3D1%3BverticalAlign%3Dtop%3Bshape%3Dmxgraph.electrical.resistors.resistor_2%3Brotation%3D-90%3B%22%20vertex%3D%221%22%20parent%3D%221%22%3E%3CmxGeometry%20x%3D%22464.4%22%20y%3D%221664%22%20width%3D%22100%22%20height%3D%2220%22%20as%3D%22geometry%22%2F%3E%3C%2FmxCell%3E%3CmxCell%20id%3D%22109%22%20value%3D%22%22%20style%3D%22endArrow%3Dnone%3Bhtml%3D1%3Brounded%3D0%3B%22%20edge%3D%221%22%20parent%3D%221%22%3E%3CmxGeometry%20width%3D%2250%22%20height%3D%2250%22%20relative%3D%221%22%20as%3D%22geometry%22%3E%3CmxPoint%20x%3D%22514.4%22%20y%3D%221724%22%20as%3D%22sourcePoint%22%2F%3E%3CmxPoint%20x%3D%22514.4%22%20y%3D%221764%22%20as%3D%22targetPoint%22%2F%3E%3C%2FmxGeometry%3E%3C%2FmxCell%3E%3CmxCell%20id%3D%2211